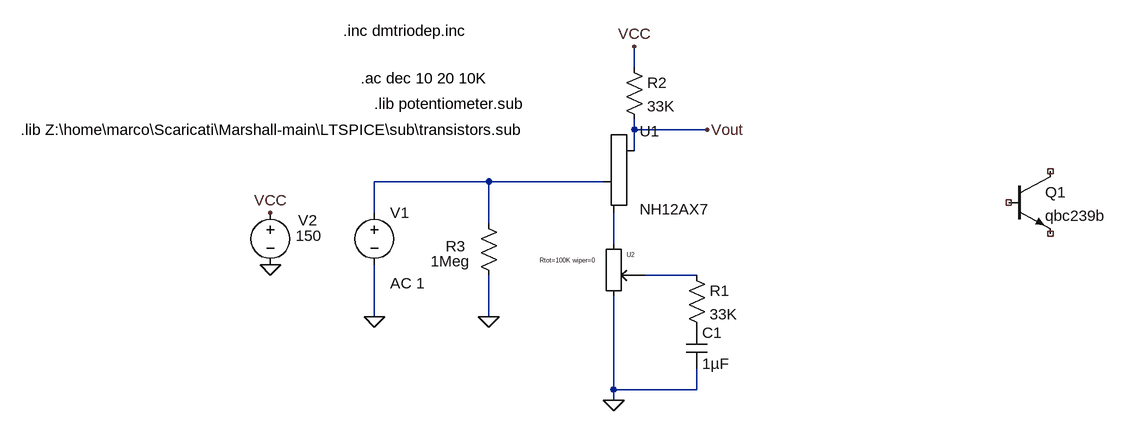
[diagram p0: schematic FrontEnd.asc]
FrontEnd.asc, the LTspice schematic file:
Version 4
SHEET 1 880 680
WIRE 80 16 80 -16
WIRE 80 112 80 96
WIRE 192 112 80 112
WIRE 80 144 80 112
WIRE -144 192 -320 192
WIRE 32 192 -144 192
WIRE -320 240 -320 192
WIRE -144 256 -144 192
WIRE 48 288 48 240
WIRE 176 336 96 336
WIRE -320 400 -320 320
WIRE -144 400 -144 336
WIRE 48 512 48 368
WIRE 176 512 176 480
WIRE 176 512 48 512
WIRE 48 528 48 512
FLAG 48 528 0
FLAG 80 -16 VCC
FLAG -144 400 0
FLAG -320 400 0
FLAG 192 112 Vout
FLAG -480 240 VCC
FLAG -480 320 0
SYMBOL Misc\\triode 80 192 R0
SYMATTR InstName U1
SYMATTR Value NH12AX7
SYMBOL res 160 320 R0
SYMATTR InstName R1
SYMATTR Value 33K
SYMBOL res 64 0 R0
SYMATTR InstName R2
SYMATTR Value 33K
SYMBOL potentiometerEU 32 272 R0
WINDOW 3 -98 41 Left 0
SYMATTR InstName U2
SYMATTR Value Rtot=100K wiper=0
SYMBOL cap 160 416 R0
SYMATTR InstName C1
SYMATTR Value 1µF
SYMBOL res -160 240 R0
WINDOW 0 -50 51 Left 2
WINDOW 3 -73 74 Left 2
SYMATTR InstName R3
SYMATTR Value 1Meg
SYMBOL voltage -320 224 R0
WINDOW 123 24 124 Left 2
WINDOW 39 0 0 Left 0
SYMATTR InstName V1
SYMATTR Value ""
SYMATTR Value2 AC 1
SYMBOL voltage -480 224 R0
WINDOW 0 43 27 Left 2
WINDOW 3 39 51 Left 2
WINDOW 39 0 0 Left 0
SYMATTR InstName V2
SYMATTR Value 150
SYMBOL npn 656 176 R0
SYMATTR InstName Q1
SYMATTR Value qbc239b
TEXT -368 -40 Left 2 !.inc dmtriodep.inc
TEXT -341 33 Left 2 !.ac dec 10 20 10K
TEXT -320 72 Left 2 !.lib potentiometer.sub
TEXT -864 112 Left 2 !.lib Z:\\home\\marco\\Scaricati\\Marshall-main\\LTSPICE\\sub\\transistors.sub

The netlist it stands for:
* FrontEnd.asc
XU1 Vout N001 N002 NH12AX7
R1 N003 P001 33K
R2 VCC Vout 33K
XU2 N002 0 N003 potentiometer Rtot=100K wiper=0  ; pins A B C
C1 P001 0 1µF
R3 N001 0 1Meg
V1 N001 0 AC 1
V2 VCC 0 150
Q1 NC_01 NC_02 NC_03 0 qbc239b
.model NPN NPN
.model PNP PNP
.lib standard.bjt
.inc dmtriodep.inc
.ac dec 10 20 10K
.lib potentiometer.sub
.lib Z:\home\marco\Scaricati\Marshall-main\LTSPICE\sub\transistors.sub
.backanno
.end